# EAGLE design NuEVI (EAGLE 7.6.0)
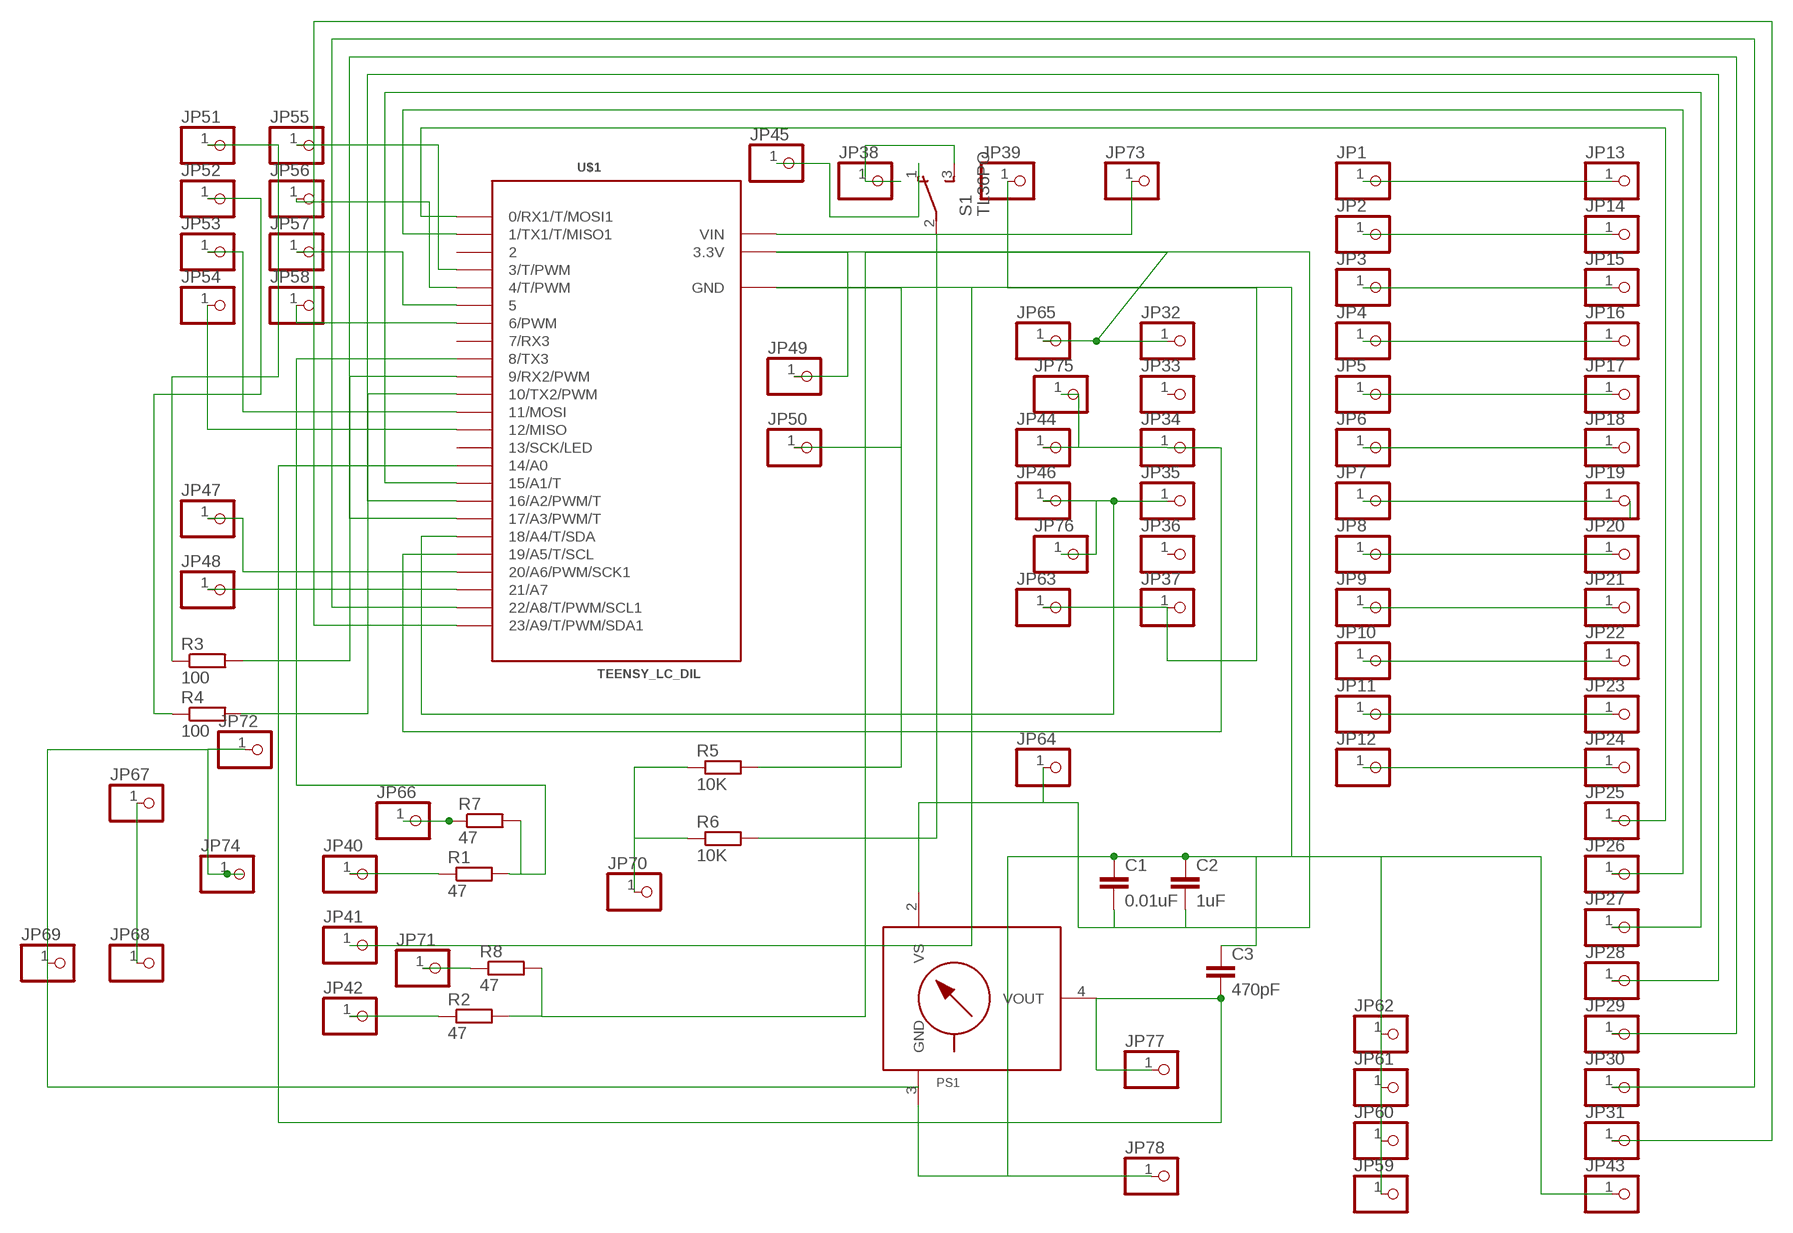
[diagram p0: schematic, sheet 1]

## Parts
C1  0.01uF  C-EU050-024X044  [C050-024X044]
C2  1uF  C-EU050-024X044  [C050-024X044]
C3  470pF  C-EU050-024X044  [C050-024X044]
JP1  PINHD-1X1  [1X01]
JP2  PINHD-1X1  [1X01]
JP3  PINHD-1X1  [1X01]
JP4  PINHD-1X1  [1X01]
JP5  PINHD-1X1  [1X01]
JP6  PINHD-1X1  [1X01]
JP7  PINHD-1X1  [1X01]
JP8  PINHD-1X1  [1X01]
JP9  PINHD-1X1  [1X01]
JP10  PINHD-1X1  [1X01]
JP11  PINHD-1X1  [1X01]
JP12  PINHD-1X1  [1X01]
JP13  PINHD-1X1  [1X01]
JP14  PINHD-1X1  [1X01]
JP15  PINHD-1X1  [1X01]
JP16  PINHD-1X1  [1X01]
JP17  PINHD-1X1  [1X01]
JP18  PINHD-1X1  [1X01]
JP19  PINHD-1X1  [1X01]
JP20  PINHD-1X1  [1X01]
JP21  PINHD-1X1  [1X01]
JP22  PINHD-1X1  [1X01]
JP23  PINHD-1X1  [1X01]
JP24  PINHD-1X1  [1X01]
JP25  PINHD-1X1  [1X01]
JP26  PINHD-1X1  [1X01]
JP27  PINHD-1X1  [1X01]
JP28  PINHD-1X1  [1X01]
JP29  PINHD-1X1  [1X01]
JP30  PINHD-1X1  [1X01]
JP31  PINHD-1X1  [1X01]
JP32  PINHD-1X1  [1X01]
JP33  PINHD-1X1  [1X01]
JP34  PINHD-1X1  [1X01]
JP35  PINHD-1X1  [1X01]
JP36  PINHD-1X1  [1X01]
JP37  PINHD-1X1  [1X01]
JP38  PINHD-1X1  [1X01]
JP39  PINHD-1X1  [1X01]
JP40  PINHD-1X1  [1X01]
JP41  PINHD-1X1  [1X01]
JP42  PINHD-1X1  [1X01]
JP43  PINHD-1X1  [1X01]
JP44  PINHD-1X1  [1X01]
JP45  PINHD-1X1  [1X01]
JP46  PINHD-1X1  [1X01]
JP47  PINHD-1X1  [1X01]
JP48  PINHD-1X1  [1X01]
JP49  PINHD-1X1  [1X01]
JP50  PINHD-1X1  [1X01]
JP51  PINHD-1X1  [1X01]
JP52  PINHD-1X1  [1X01]
JP53  PINHD-1X1  [1X01]
JP54  PINHD-1X1  [1X01]
JP55  PINHD-1X1  [1X01]
JP56  PINHD-1X1  [1X01]
JP57  PINHD-1X1  [1X01]
JP58  PINHD-1X1  [1X01]
JP59  PINHD-1X1  [1X01]
JP60  PINHD-1X1  [1X01]
JP61  PINHD-1X1  [1X01]
JP62  PINHD-1X1  [1X01]
JP63  PINHD-1X1  [1X01]
JP64  PINHD-1X1  [1X01]
JP65  PINHD-1X1  [1X01]
JP66  PINHD-1X1  [1X01]
JP67  PINHD-1X1  [1X01]
JP68  PINHD-1X1  [1X01]
JP69  PINHD-1X1  [1X01]
JP70  PINHD-1X1  [1X01]
JP71  PINHD-1X1  [1X01]
JP72  PINHD-1X1  [1X01]
JP73  PINHD-1X1  [1X01]
JP74  PINHD-1X1  [1X01]
JP75  PINHD-1X1  [1X01]
JP76  PINHD-1X1  [1X01]
JP77  PINHD-1X1  [1X01]
JP78  PINHD-1X1  [1X01]
PS1  MPX-1369  [1369]
R1  47  R-EU_0207/7  [0207/7]
R2  47  R-EU_0207/7  [0207/7]
R3  100  R-EU_0207/7  [0207/7]
R4  100  R-EU_0207/7  [0207/7]
R5  10K  R-EU_0207/7  [0207/7]
R6  10K  R-EU_0207/7  [0207/7]
R7  47  R-EU_0207/7  [0207/7]
R8  47  R-EU_0207/7  [0207/7]
S1  TL36PO  [TL3XPO]
U$1  TEENSY_LC_DIL  [TEENSY_3.0-3.2&LC_DIL]

## Nets
GND: C1.1 C2.1 C3.1 JP37.1 JP39.1 JP41.1 JP43.1 JP50.1 JP59.1 JP60.1 JP61.1 JP62.1 JP63.1 JP69.1 JP72.1 JP74.1 JP78.1 PS1.3(GND) R5.2 U$1.AGND(GND) U$1.GND
N$1: JP1.1 JP13.1
N$2: JP2.1 JP14.1
N$3: JP3.1 JP15.1
N$4: JP4.1 JP16.1
N$5: JP5.1 JP17.1
N$6: JP6.1 JP18.1
N$8: JP7.1 JP19.1
N$9: JP8.1 JP20.1
N$10: JP9.1 JP21.1
N$11: JP10.1 JP22.1
N$12: JP11.1 JP23.1
N$13: JP25.1 U$1.0(0/RX1/T/MOSI1)
N$14: JP12.1 JP24.1
N$15: JP26.1 U$1.1(1/TX1/T/MISO1)
N$16: JP27.1 U$1.15/A1(15/A1/T)
N$17: JP28.1 U$1.16/A2(16/A2/PWM/T)
N$18: JP29.1 U$1.17/A3(17/A3/PWM/T)
N$19: JP30.1 U$1.22/A8(22/A8/T/PWM/SCL1)
N$20: JP31.1 U$1.23/A9(23/A9/T/PWM/SDA1)
N$21: C1.2 C2.2 JP32.1 JP49.1 JP64.1 JP65.1 PS1.2(VS) R2.2 R8.2 U$1.3.3V
N$22: JP47.1 U$1.20/A6(20/A6/PWM/SCK1)
N$23: JP34.1 JP44.1 JP75.1 U$1.19/A5(19/A5/T/SCL)
N$24: JP35.1 JP46.1 JP76.1 U$1.18/A4(18/A4/T/SDA)
N$25: JP38.1 S1.3(S)
N$26: R1.2 R7.2 U$1.8(8/TX3)
N$27: JP40.1 R1.1
N$28: JP42.1 R2.1
N$29: C3.2 JP77.1 PS1.4(VOUT) U$1.14/A0
N$30: JP73.1 R6.2 S1.2(P) U$1.VIN
N$31: JP48.1 U$1.21/A7
N$32: JP51.1 R3.1
N$33: JP52.1 R4.1
N$34: JP53.1 U$1.11(11/MOSI)
N$35: JP54.1 U$1.12(12/MISO)
N$36: JP55.1 U$1.3(3/T/PWM)
N$37: JP56.1 U$1.4(4/T/PWM)
N$38: JP57.1 U$1.5
N$39: JP58.1 U$1.6(6/PWM)
N$40: JP45.1 S1.1(O)
N$41: R4.2 U$1.10(10/TX2/PWM)
N$42: JP67.1 JP68.1
N$43: R3.2 U$1.9(9/RX2/PWM)
N$46: JP70.1 R5.1 R6.1
N$47: JP71.1 R8.1
N$48: JP66.1 R7.1
Unconnected: JP33.1 JP36.1 PS1.1(NC) PS1.5(NC) PS1.6(NC) U$1.2 U$1.7(7/RX3) U$1.13(13/SCK/LED)

## Library data of the parts
C1-C3 = rcl:C-EU: CAPACITOR, European symbol
JP1-JP78 = pinhead:PINHD-1X1: PIN HEADER
PS1 = mpx-freescale:MPX*****: Generic MPX pressure sensor
R1-R8 = resistor:R-EU_: RESISTOR, European symbol
S1 = switch:TL36PO: TINY SWITCH ON - ON Source: http://www2.produktinfo.conrad.com/datenblaetter/700000-724999/705152-da-01-de-Subminiaturschalter_TL_36YO.pdf
U$1 = Teensy_3_and_LC_Series_Boards_v1.4:TEENSY_LC_DIL

## Board
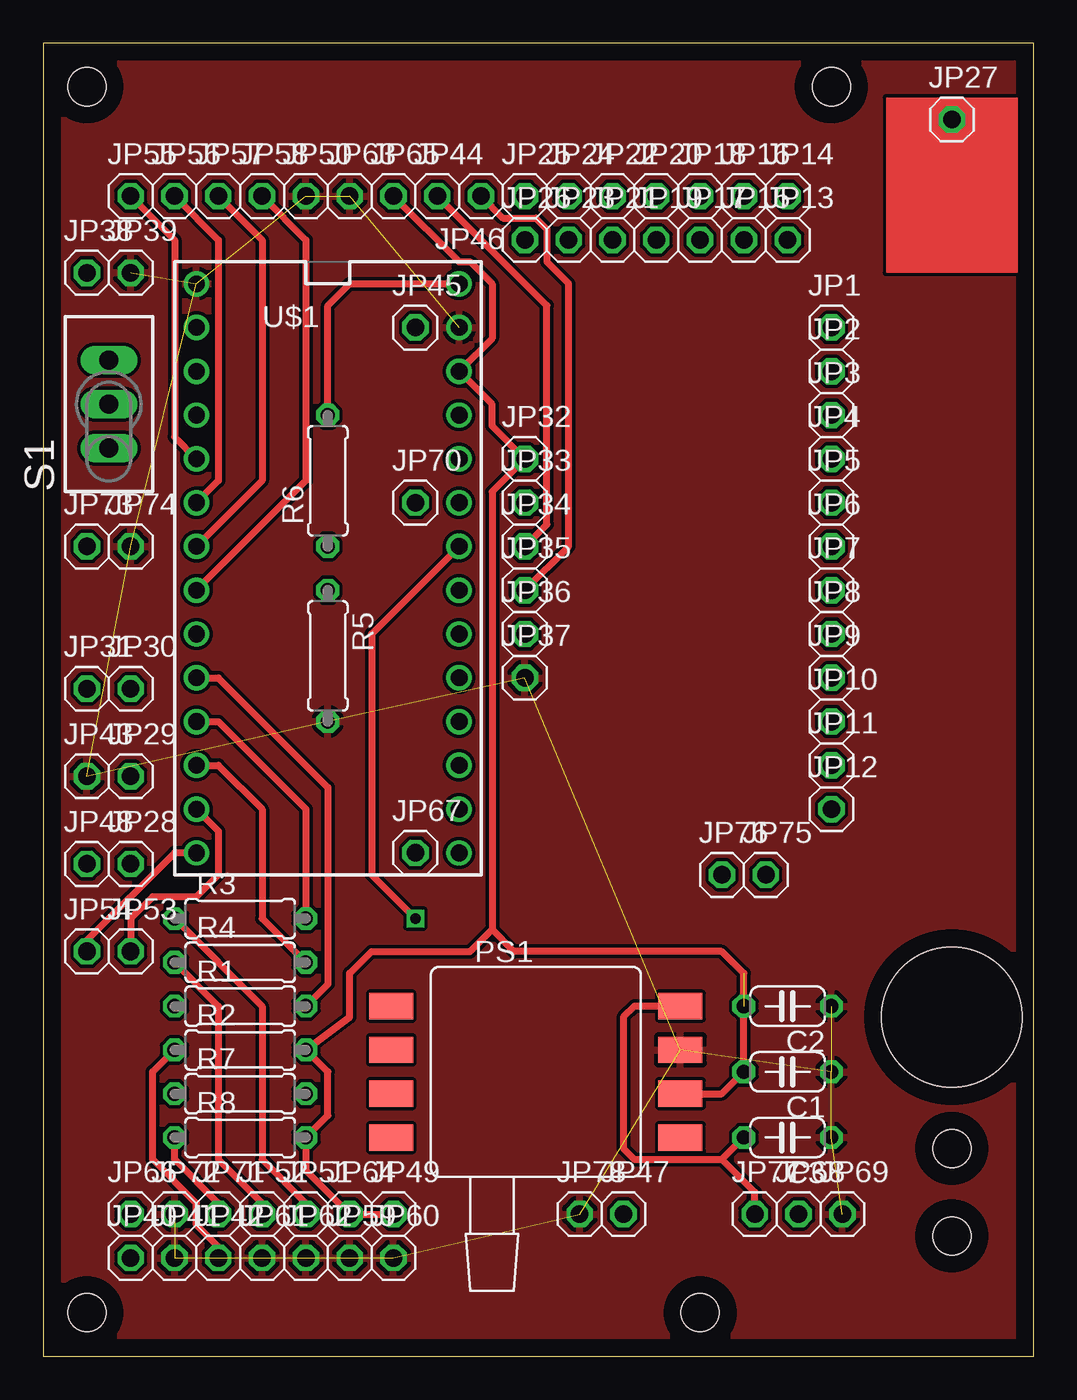
[diagram p1: board, top side]
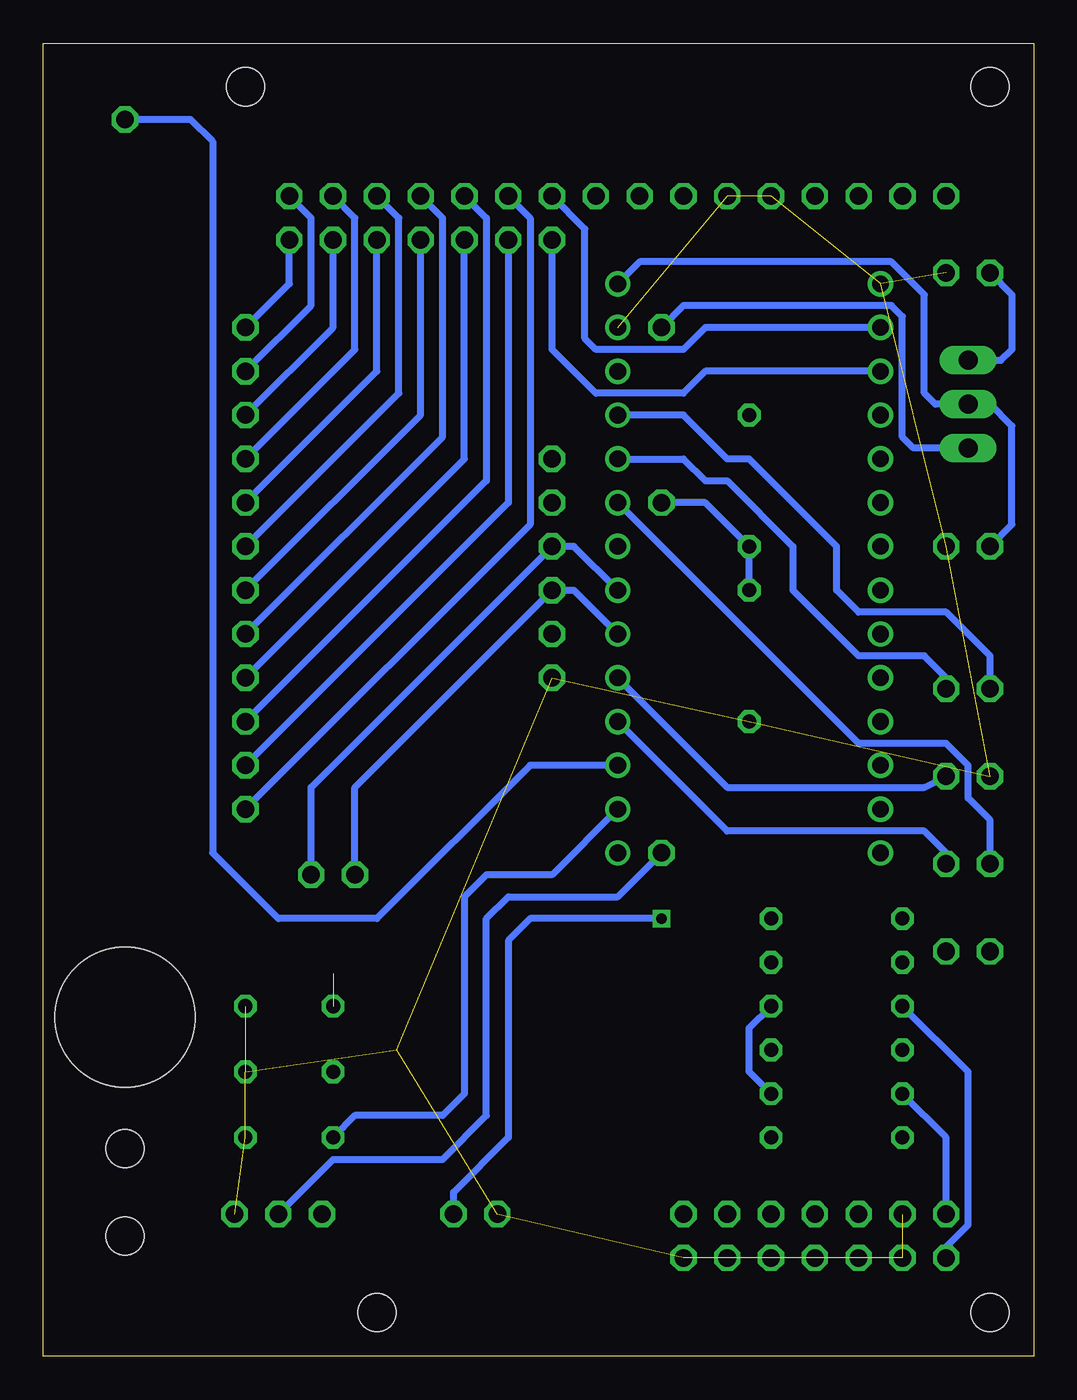
[diagram p2: board, bottom side, seen from below]

Size 57.45 x 76.19 mm. Coordinates in mm from the lower left corner, seen from the top.
Outline: 0,0 57.45,0 57.45,76.19 0,76.19 0,0
Copper layers (1*16): Top 0.035mm / dielectric 1.5mm / Bottom 0.035mm
Design rules "default": minimum track width 10mil, minimum drill 24mil, track to track 8mil, track to pad 8mil, pad to pad 8mil, via to via 8mil, smd to smd 8mil, copper to edge 40mil, drill to drill 8mil, minimum pad ring 10mil, minimum via ring 8mil, stop-mask expansion 4mil, vias tented up to drill 0mil, thermal gap 10mil
Holes 2.2 mm at 2.54,73.66 45.72,73.66 2.54,2.54 38.1,2.54 52.7,6.99 52.7,12.06
Holes 8.13 mm at 52.7,19.68

### Footprints (pad centres in the part's own frame; a part is rotated, then mirrored left to right if it is on the bottom)
C050-024X044 = drill 0.813 octagon: 1 -2.54,0; 2 2.54,0
1X01 = drill 1.016 octagon: 1 0,0
1369 = smd 2.54 x 1.524: 1 8.382,-3.81; 2 8.382,-1.27; 3 8.382,1.27; 4 8.382,3.81; 5 -8.382,3.81; 6 -8.382,1.27; 7 -8.382,-1.27; 8 -8.382,-3.81
0207/7 = drill 0.813 octagon: 1 -3.81,0; 2 3.81,0
TL3XPO = drill 1.1 pad 1.422 long: 1 -2.54,0; 2 0,0; 3 2.54,0
TEENSY_3.0-3.2&LC_DIL = drill 0.965: 0 -7.62,13.97; 1 -7.62,11.43; 2 -7.62,8.89; 3 -7.62,6.35; 3.3V 7.62,11.43; 4 -7.62,3.81; 5 -7.62,1.27; 6 -7.62,-1.27; 7 -7.62,-3.81; 8 -7.62,-6.35; 9 -7.62,-8.89; 10 -7.62,-11.43; 11 -7.62,-13.97; 12 -7.62,-16.51; 13 7.62,-16.51; 14/A0 7.62,-13.97; 15/A1 7.62,-11.43; 16/A2 7.62,-8.89; 17/A3 7.62,-6.35; 18/A4 7.62,-3.81; 19/A5 7.62,-1.27; 20/A6 7.62,1.27; 21/A7 7.62,3.81; 22/A8 7.62,6.35; 23/A9 7.62,8.89; AGND 7.62,13.97; GND -7.62,16.51; VIN 7.62,16.51

### Placement (x,y rotation side)
C1  43.18,16.51 180 top
C2  43.18,20.32 180 top
C3  43.18,12.7 180 top
JP1  45.72,59.69 0 top
JP2  45.72,57.15 0 top
JP3  45.72,54.61 0 top
JP4  45.72,52.07 0 top
JP5  45.72,49.53 0 top
JP6  45.72,46.99 0 top
JP7  45.72,44.45 0 top
JP8  45.72,41.91 0 top
JP9  45.72,39.37 0 top
JP10  45.72,36.83 0 top
JP11  45.72,34.29 0 top
JP12  45.72,31.75 0 top
JP13  43.18,64.77 0 top
JP14  43.18,67.31 0 top
JP15  40.64,64.77 0 top
JP16  40.64,67.31 0 top
JP17  38.1,64.77 0 top
JP18  38.1,67.31 0 top
JP19  35.56,64.77 0 top
JP20  35.56,67.31 0 top
JP21  33.02,64.77 0 top
JP22  33.02,67.31 0 top
JP23  30.48,64.77 0 top
JP24  30.48,67.31 0 top
JP25  27.94,67.31 0 top
JP26  27.94,64.77 0 top
JP27  52.7,71.75 0 top
JP28  5.08,28.57 0 top
JP29  5.08,33.66 0 top
JP30  5.08,38.73 0 top
JP31  2.54,38.73 0 top
JP32  27.94,52.07 0 top
JP33  27.94,49.53 0 top
JP34  27.94,46.99 0 top
JP35  27.94,44.45 0 top
JP36  27.94,41.91 0 top
JP37  27.94,39.37 0 top
JP38  2.54,62.87 0 top
JP39  5.08,62.87 0 top
JP40  5.08,5.71 0 top
JP41  7.62,5.71 0 top
JP42  10.16,5.71 0 top
JP43  2.54,33.66 0 top
JP44  22.86,67.31 0 top
JP45  21.59,59.69 0 top
JP46  25.4,67.31 180 top
JP47  33.66,8.26 0 top
JP48  2.54,28.57 0 top
JP49  20.32,8.26 0 top
JP50  15.24,67.31 0 top
JP51  15.24,8.26 0 top
JP52  12.7,8.26 0 top
JP53  5.08,23.5 0 top
JP54  2.54,23.5 0 top
JP55  5.08,67.31 0 top
JP56  7.62,67.31 0 top
JP57  10.16,67.31 0 top
JP58  12.7,67.31 0 top
JP59  17.78,5.71 0 top
JP60  20.32,5.71 0 top
JP61  12.7,5.71 0 top
JP62  15.24,5.71 0 top
JP63  17.78,67.31 0 top
JP64  17.78,8.26 0 top
JP65  20.32,67.31 0 top
JP66  5.08,8.26 0 top
JP67  21.59,29.21 0 top
JP68  43.81,8.26 0 top
JP69  46.35,8.26 0 top
JP70  21.59,49.53 0 top
JP71  10.16,8.26 0 top
JP72  7.62,8.26 0 top
JP73  2.54,46.99 0 top
JP74  5.08,46.99 0 top
JP75  41.91,27.94 0 top
JP76  39.37,27.94 0 top
JP77  41.27,8.26 0 top
JP78  31.11,8.26 0 top
PS1  28.57,16.51 0 top
R1  11.43,20.32 0 top
R2  11.43,17.78 0 top
R3  11.43,25.4 0 top
R4  11.43,22.86 0 top
R5  16.51,40.64 270 top
R6  16.51,50.8 90 top
R7  11.43,15.24 0 top
R8  11.43,12.7 0 top
S1  3.81,55.24 90 top
U$1  16.51,45.72 0 top

### Tracks (layer width: path | path; a pad name or v marks a point on that pad's centre or on a via)
GND  (20 unrouted)
  pour Top: 0,76.2 57.78,76.2 57.78,0 0,0
N$1
  Bottom 0.406: JP1.1 43.18,62.23 JP13.1
N$2
  Bottom 0.406: JP2.1 41.91,60.96 41.91,66.04 JP14.1
N$3
  Bottom 0.406: JP3.1 40.64,59.69 JP15.1
N$4
  Bottom 0.406: JP4.1 39.37,58.42 39.37,66.04 JP16.1
N$5
  Bottom 0.406: JP5.1 38.1,57.15 JP17.1
N$6
  Bottom 0.406: JP6.1 36.83,55.88 36.83,66.04 JP18.1
N$8
  Bottom 0.406: JP7.1 35.56,54.61 JP19.1
N$9
  Bottom 0.406: JP8.1 34.29,53.34 34.29,66.04 JP20.1
N$10
  Bottom 0.406: JP9.1 33.02,52.07 JP21.1
N$11
  Bottom 0.406: JP22.1 31.75,66.04 31.75,50.8 JP10.1
N$12
  Bottom 0.406: JP23.1 30.48,49.53 JP11.1
N$13
  Bottom 0.406: U$1.0 19.05,59.69 20.32,58.42 25.4,58.42 26.04,59.05 26.04,65.41 JP25.1
N$14
  Bottom 0.406: JP24.1 29.21,66.04 29.21,48.26 JP12.1
N$15
  Bottom 0.406: U$1.1 19.05,57.15 20.32,55.88 25.4,55.88 27.94,58.42 JP26.1
N$16
  Bottom 0.406: U$1.15/A1 29.21,34.29 38.1,25.4 43.81,25.4 47.62,29.21 47.62,70.48 48.9,71.75 JP27.1
N$17
  Bottom 0.406: JP28.1 5.08,29.21 6.35,30.48 17.78,30.48 U$1.16/A2
N$18
  Bottom 0.406: U$1.17/A3 17.78,33.02 6.35,33.02 JP29.1
N$19
  Bottom 0.406: JP30.1 5.08,39.37 6.35,40.64 10.16,40.64 13.97,44.45 13.97,46.99 17.78,50.8 19.05,50.8 20.32,52.07 U$1.22/A8
N$20
  Bottom 0.406: JP31.1 2.54,40.64 5.08,43.18 10.16,43.18 11.43,44.45 11.43,46.99 16.51,52.07 17.78,52.07 20.32,54.61 U$1.23/A9
N$21  (1 unrouted)
  Top 0.406: 26.04,24.77 26.04,50.16 JP32.1 26.04,53.98 26.04,55.24 U$1.3.3V 26.04,59.05 26.04,62.23 24.77,63.5 24.13,63.5 JP65.1 | 26.04,24.77 24.77,23.5 19.05,23.5 17.78,22.23 17.78,19.68 R2.2 16.51,16.51 16.51,13.97 R8.2 15.24,10.79 JP64.1 JP49.1 | PS1.2 39.37,15.24 C1.2 40.64,22.23 39.37,23.5 27.3,23.5 26.04,24.77
N$22  (via drill 0.6)
  Top 0.406: U$1.20/A6 19.05,41.91 19.05,27.94 v21.59,25.4
  Bottom 0.406: v21.59,25.4 29.21,25.4 30.48,24.13 30.48,12.7 33.66,9.53 JP47.1
N$23
  Top 0.406: JP34.1 29.21,48.26 29.21,60.96 JP44.1
  Bottom 0.406: U$1.19/A5 26.67,46.99 JP34.1 41.91,33.02 JP75.1
N$24
  Top 0.406: JP35.1 30.48,46.99 30.48,62.23 29.21,63.5 29.21,65.41 28.57,66.04 26.67,66.04 JP46.1
  Bottom 0.406: U$1.18/A4 26.67,44.45 JP35.1 39.37,33.02 JP76.1
N$25
  Bottom 0.406: S1.3 1.91,57.78 1.27,58.42 1.27,61.59 JP38.1
N$26
  Top 0.406: U$1.8 10.16,39.37 16.51,33.02 16.51,21.59 R1.2
  Bottom 0.406: R7.2 16.51,16.51 16.51,19.05 R1.2
N$27
  Bottom 0.406: JP40.1 5.08,6.35 3.81,7.62 3.81,16.51 R1.1
N$28
  Top 0.406: JP42.1 10.16,6.35 8.89,7.62 8.89,8.89 6.35,11.43 6.35,16.51 R2.1
N$29
  Top 0.406: PS1.4 34.29,20.32 33.66,19.68 33.66,12.06 34.29,11.43 39.37,11.43 | 39.37,11.43 C3.2 | JP77.1 41.27,9.53 39.37,11.43
  Bottom 0.406: U$1.14/A0 27.94,27.94 31.75,27.94 33.02,26.67 33.02,15.24 34.29,13.97 39.37,13.97 C3.2
N$30
  Top 0.406: R6.2 16.51,60.96 17.78,62.23 U$1.VIN
  Bottom 0.406: U$1.VIN 22.86,63.5 8.26,63.5 6.35,61.59 6.35,55.88 5.71,55.24 S1.2 2.54,55.24 1.27,53.98 1.27,48.26 JP73.1
N$31
  Bottom 0.406: JP48.1 2.54,31.11 3.81,32.38 3.81,34.29 5.08,35.56 10.16,35.56 U$1.21/A7
N$32
  Top 0.406: R3.1 12.7,20.32 12.7,11.43 15.24,8.89 JP51.1
N$33
  Top 0.406: R4.1 10.16,20.32 10.16,11.43 12.7,8.89 JP52.1
N$34
  Top 0.406: U$1.11 10.16,30.48 10.16,27.94 8.89,26.67 6.35,26.67 5.08,25.4 JP53.1
N$35
  Top 0.406: U$1.12 7.62,29.21 2.54,24.13 JP54.1
N$36
  Top 0.406: JP55.1 7.62,64.77 7.62,53.34 U$1.3
N$37
  Top 0.406: JP56.1 10.16,64.77 10.16,50.8 U$1.4
N$38
  Top 0.406: JP57.1 12.7,64.77 12.7,50.8 U$1.5
N$39
  Top 0.406: JP58.1 15.24,64.77 15.24,50.8 U$1.6
N$40
  Bottom 0.406: S1.1 6.99,52.7 7.62,53.34 7.62,60.33 8.26,60.96 20.32,60.96 JP45.1
N$41
  Top 0.406: U$1.10 10.16,34.29 12.7,31.75 12.7,25.4 R4.2
N$42
  Bottom 0.406: JP68.1 40.64,11.43 34.29,11.43 31.75,13.97 31.75,25.4 30.48,26.67 24.13,26.67 JP67.1
N$43
  Top 0.406: U$1.9 10.16,36.83 15.24,31.75 R3.2
N$46
  Bottom 0.406: JP70.1 19.05,49.53 R6.1 R5.1
N$47
  Top 0.406: JP71.1 10.16,8.89 7.62,11.43 R8.1
N$48
  Bottom 0.406: JP66.1 5.08,12.7 R7.1
(copper drawn outside any net)
  shapes: Top area x1

### Text on the board
tScreen: VIBRATO | NAV | OLED | KEYS/ROLLERS | D | E | U | M | GND | SCL | SK | R1 | R2 | R3 | R4 | R5 | K4 | BAT | GND | Vcc | SDA | + | - | PD | K1 | K2 | K3 | K5 | K6 | K7 | VUSB | TEENSY | MPR121 | 10K | PWR | + | - | RAW/SW | 10K | Pu | Pd | BITE | SDA | SCL | A7 | EC | 100 | Johan Berglund 2018 | NuEVI main board | 100 | 12 | 11 | 47 | 103 | 47 | 47 | 105 | 47 | MP3V5004GP | MIDI | B | LED | P | Vcc | 471 | GND | A6 | BCV | + | DAC | - | S | G | + | GND | GND